# EasyEDA Pro project ProPrj_AD采集模组_2025-10-15.epro, schematic Schematic1
Board Name: AD采集; Create Date: 2025-08-20; Page Name: P1; Project Name: AD采集模组; Schematic Name: Schematic1; Update Date: 2025-09-16; Company: 嘉立创EDA; Page Size: A4; Version: V1.0
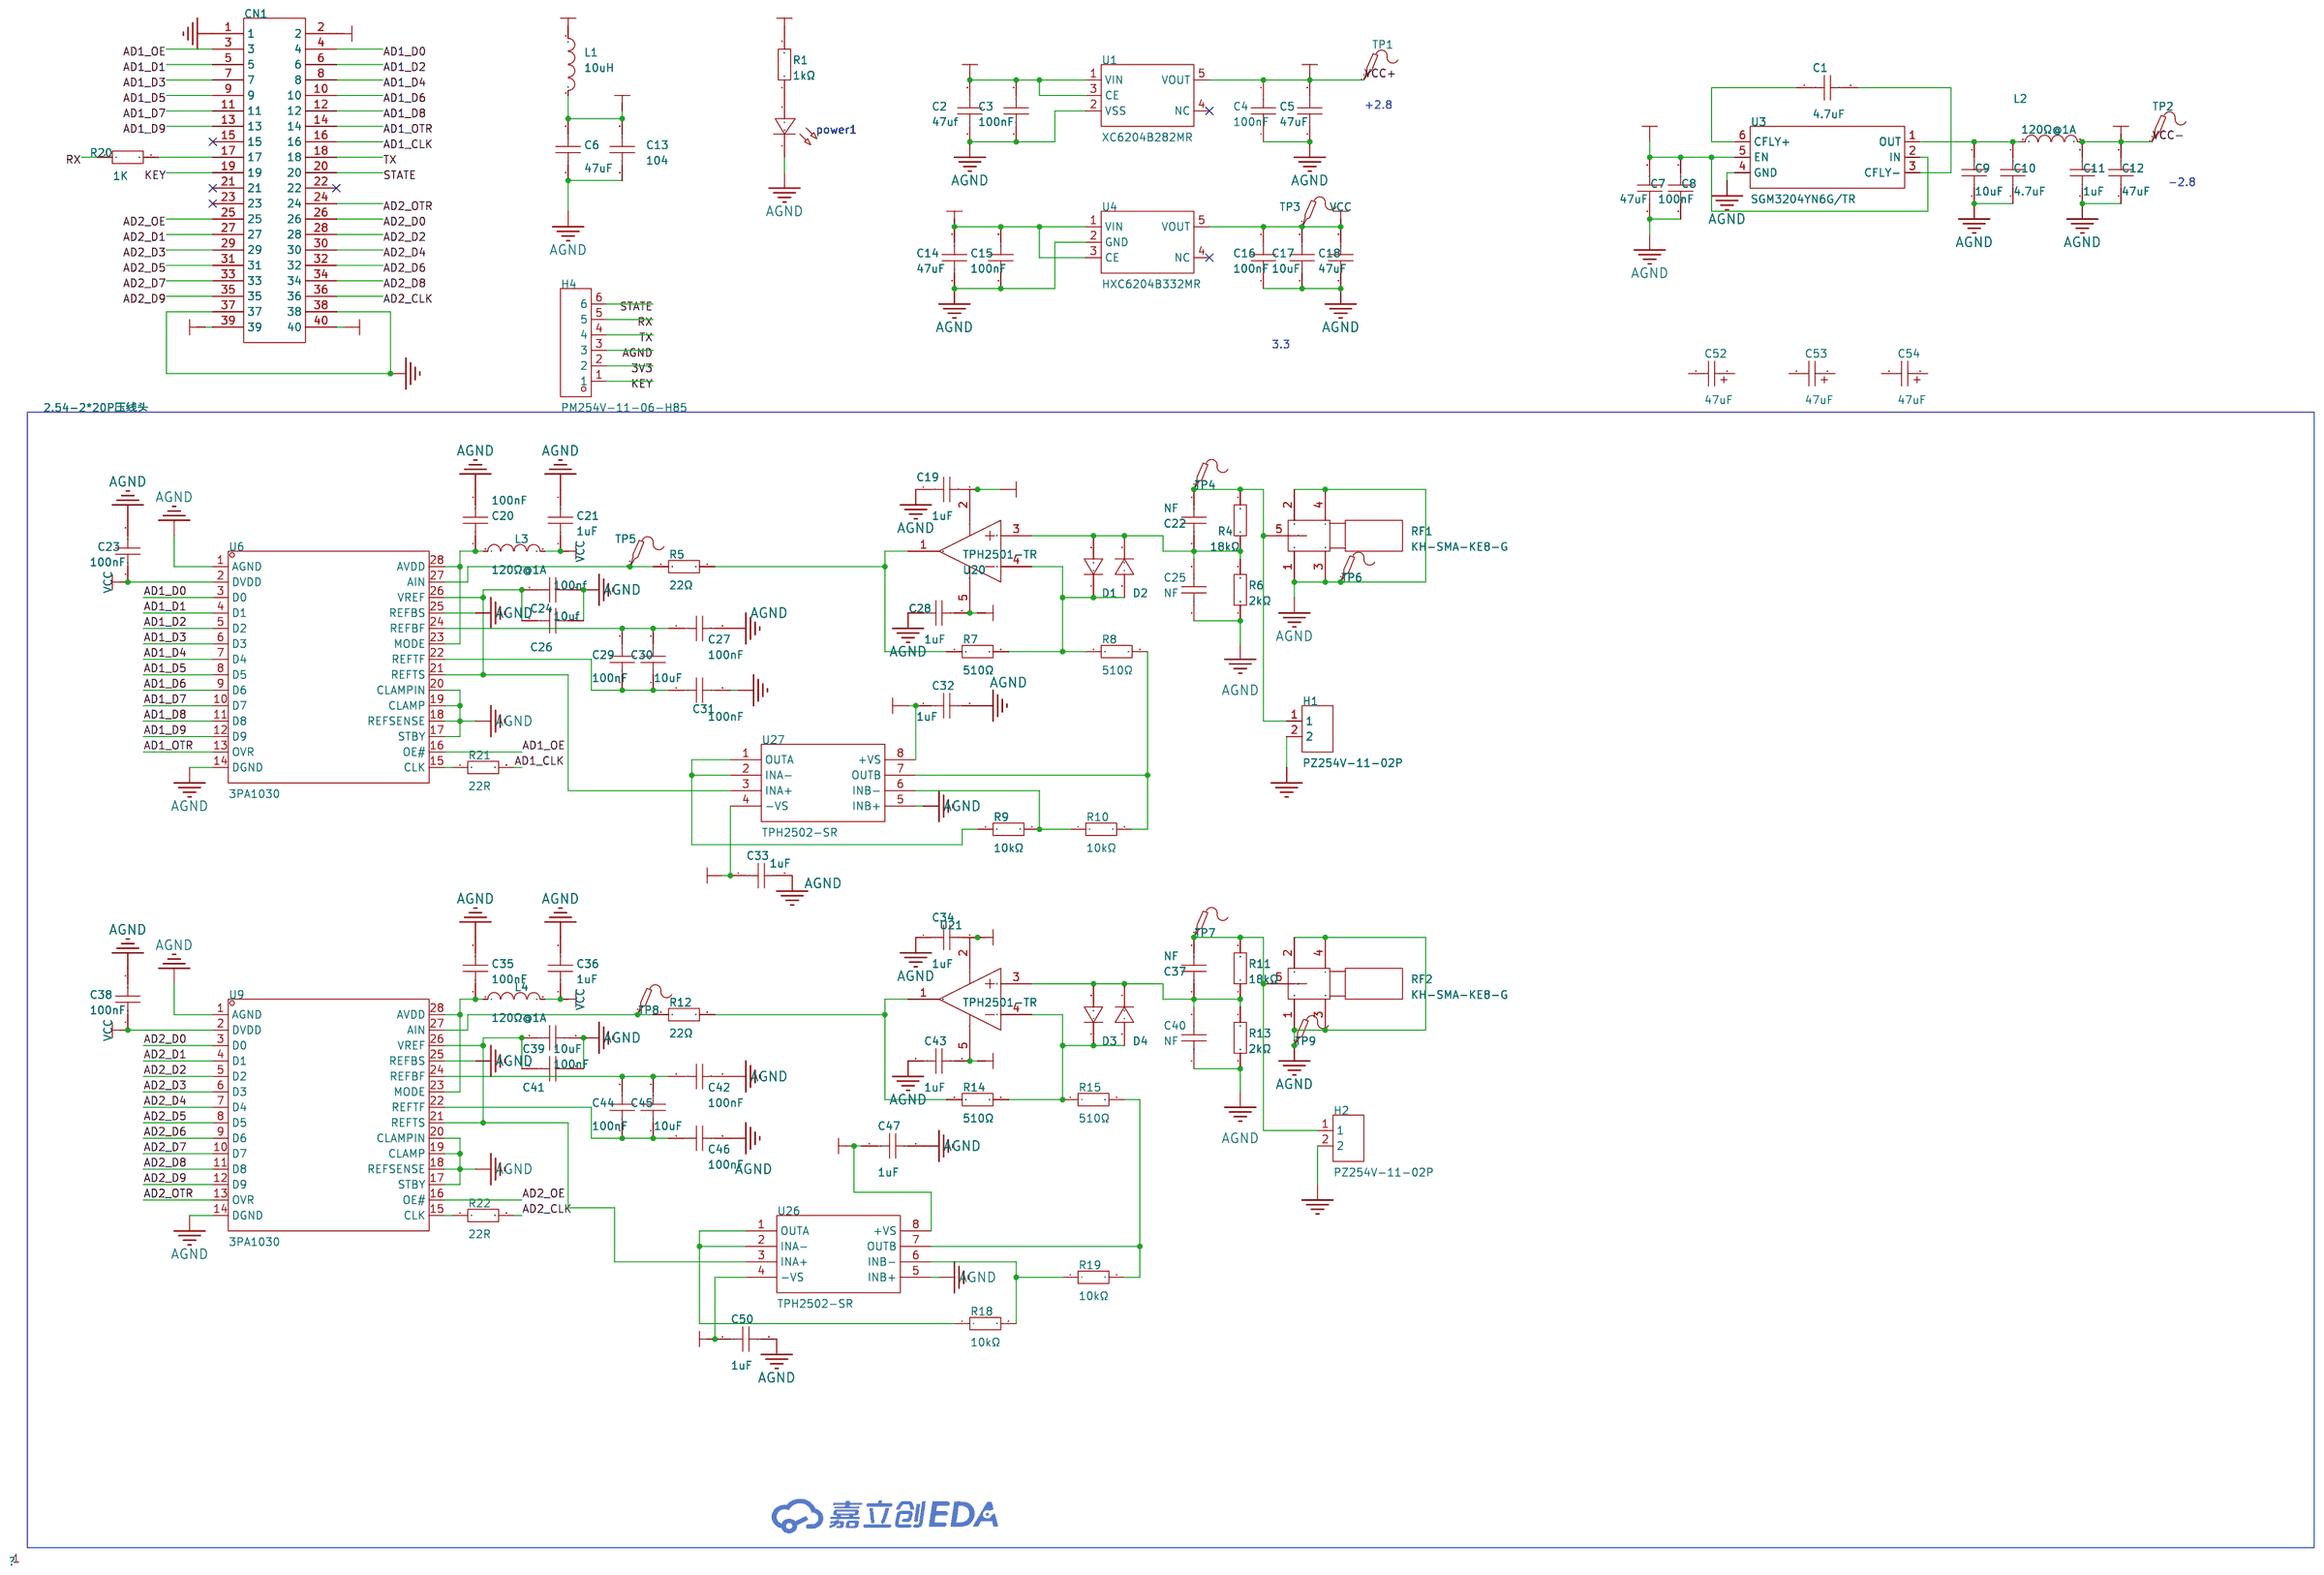
[diagram p0: schematic sheet]

## Parts
C1  4.7uF  [C0603]
C2  47uf  [C0603]
C3  100nF  [C0603]
C4  100nF  [C0603]
C5  47uF  [C0603]
C6  47uF  [C0603]
C7  47uF  [C0603]
C8  100nF  [C0603]
C9  10uF  [C0603]
C10  4.7uF  [C0603]
C11  1uF  [C0603]
C12  47uF  [C0603]
C13  100nF  [C0603]
C14  47uF  [C0603]
C15  100nF  [C0603]
C16  100nF  [C0603]
C17  10uF  [C0603]
C18  47uF  [C0603]
C19  1uF  [C0603]
C20  100nF  [C0603]
C21  1uF  [C0603]
C22  NF  [C0603]
C23  100nF  [C0603]
C24  100nf  [C0603]
C25  NF  [C0603]
C26  10uf  [C0603]
C27  100nF  [C0603]
C28  1uF  [C0603]
C29  100nF  [C0603]
C30  10uF  [C0603]
C31  100nF  [C0603]
C32  1uF  [C0603]
C33  1uF  [C0603]
C34  1uF  [C0603]
C35  100nF  [C0603]
C36  1uF  [C0603]
C37  NF  [C0603]
C38  100nF  [C0603]
C39  10uF  [C0603]
C40  NF  [C0603]
C41  100nF  [C0603]
C42  100nF  [C0603]
C43  1uF  [C0603]
C44  100nF  [C0603]
C45  10uF  [C0603]
C46  100nF  [C0603]
C47  1uF  [C0603]
C50  1uF  [C0603]
C52  47uF  [CASE-D_7343]
C53  47uF  [CASE-D_7343]
C54  47uF  [CASE-D_7343]
CN1  2.54-2*20P压线头  [HDR-TH_40P-V-H-R2-P2.54]
D1  1N4148W  [SOD-123F_L2.7-W1.6-LS3.8-RD]
D2  1N4148W  [SOD-123F_L2.7-W1.6-LS3.8-RD]
D3  1N4148W  [SOD-123F_L2.7-W1.6-LS3.8-RD]
D4  1N4148W  [SOD-123F_L2.7-W1.6-LS3.8-RD]
H1  PZ254V-11-02P  [HDR-TH_2P-P2.54-V-M]
H2  PZ254V-11-02P  [HDR-TH_2P-P2.54-V-M]
H4  PM254V-11-06-H85  [HDR-TH_6P-P2.54-V-F]
L1  10uH  [L0603]
L2  120Ω@1A  [L0603]
L3  120Ω@1A  [L0603]
L4  120Ω@1A  [L0603]
power1  LTST-C193TBKT-5A  [LED_0603]
R1  1kΩ  [R0603]
R4  18kΩ  [R0603]
R5  22Ω  [R0603]
R6  2kΩ  [R0603]
R7  510Ω  [R0603]
R8  510Ω  [R0603]
R9  10kΩ  [R0603]
R10  10kΩ  [R0603]
R11  18kΩ  [R0603]
R12  22Ω  [R0603]
R13  2kΩ  [R0603]
R14  510Ω  [R0603]
R15  510Ω  [R0603]
R18  10kΩ  [R0603]
R19  10kΩ  [R0603]
R20  1K  [R0603]
R21  22R  [R0603]
R22  22R  [R0603]
RF1  KH-SMA-KE8-G  [CONN-SMD_KH-SMA-KE8-G]
RF2  KH-SMA-KE8-G  [CONN-SMD_KH-SMA-KE8-G]
TP1  -  [Test-Point-0.5mm]
TP2  -  [Test-Point-0.5mm]
TP3  -  [Test-Point-0.5mm]
TP4  -  [Test-Point-0.5mm]
TP5  -  [Test-Point-0.5mm]
TP6  -  [Test-Point-0.5mm]
TP7  -  [Test-Point-0.5mm]
TP8  -  [Test-Point-0.5mm]
TP9  -  [Test-Point-0.5mm]
U1  XC6204B282MR  [SOT-23-5_L2.9-W1.6-P0.95-LS2.8-BR]
U3  SGM3204YN6G/TR  [SOT-23-6_L2.9-W1.6-P0.95-LS2.8-BR]
U4  HXC6204B332MR  [SOT-23-5_L3.0-W1.7-P0.95-LS2.8-BR]
U6  3PA1030  [TSSOP-28_L9.7-W4.4-P0.65-LS6.4-BL]
U9  3PA1030  [TSSOP-28_L9.7-W4.4-P0.65-LS6.4-BL]
U20  TPH2501-TR  [SOT-23-5_L3.0-W1.7-P0.95-LS2.8-BR]
U21  TPH2501-TR  [SOT-23-5_L3.0-W1.7-P0.95-LS2.8-BR]
U26  TPH2502-SR  [SOP-8_L4.9-W3.9-P1.27-LS6.0-BL]
U27  TPH2502-SR  [SOP-8_L4.9-W3.9-P1.27-LS6.0-BL]

## Library data of the parts
C1 C10 = CL10A475KA8NQNC: 容值:4.7uF;精度:±10%;额定电压:25V;温度系数:X5R;; LCSC Part Name: 4.7uF ±10% 25V; Supplier Part: C69335; Manufacturer: SAMSUNG(三星); Supplier Footprint: 0603; JLCPCB Part Class: Extended Part; Datasheet: https://item.szlcsc.com/datasheet/CL10A475KA8NQNC/70449.html; Supplier: LCSC; Tolerance: ±10%; Voltage Rating: 25V; Temperature Coefficient: X5R
C2-C5 C8 C13 C15 C16 C20 C23 C26 C27 C29 C31 C35 C38 C41 C42 C44 C46 = CC0603KRX7R9BB104: 容值:100nF;精度:±10%;额定电压:50V;温度系数:X7R;; LCSC Part Name: 100nF ±10% 50V; Supplier Part: C14663; Manufacturer: YAGEO(国巨); Supplier Footprint: 0603; JLCPCB Part Class: Basic Part; Datasheet: https://atta.szlcsc.com/upload/public/pdf/source/20250214/096C4C206003071F5D32E5F0D8E7F8DF.pdf; Supplier: LCSC; Tolerance: ±10%; Voltage Rating: 50V; Temperature Coefficient: X7R
C6 C7 C12 C14 C18 = GRM188R60J476ME15D: 容值:47uF;精度:±20%;额定电压:6.3V;温度系数:X5R;; LCSC Part Name: 47uF ±20% 6.3V; Supplier Part: C140782; Manufacturer: muRata(村田); Supplier Footprint: 0603; JLCPCB Part Class: Extended Part; Datasheet: https://item.szlcsc.com/datasheet/GRM188R60J476ME15D/152108.html; Supplier: LCSC; Tolerance: ±20%; Voltage Rating: 6.3V; Temperature Coefficient: X5R
C9 C17 C24 C30 C39 C45 = CL10A106KP8NNNC: 容值:10uF;精度:±10%;额定电压:10V;温度系数:X5R;; LCSC Part Name: 10uF ±10% 10V; Supplier Part: C19702; Manufacturer: SAMSUNG(三星); Supplier Footprint: 0603; JLCPCB Part Class: Basic Part; Datasheet: https://item.szlcsc.com/datasheet/CL10A106KP8NNNC/20411.html; Supplier: LCSC; Tolerance: ±10%; Voltage Rating: 10V; Temperature Coefficient: X5R
C11 C19 C21 C28 C32-C34 C36 C43 C47 C50 = CL10A105KB8NNNC: 容值:1uF;精度:±10%;额定电压:50V;温度系数:X5R;; LCSC Part Name: 1uF ±10% 50V; Supplier Part: C15849; Manufacturer: SAMSUNG(三星); Supplier Footprint: 0603; JLCPCB Part Class: Basic Part; Datasheet: https://item.szlcsc.com/datasheet/CL10A105KB8NNNC/16531.html; Supplier: LCSC; Tolerance: ±10%; Voltage Rating: 50V; Temperature Coefficient: X5R
C22 C25 C37 C40 = CAP_0603: Supplier Footprint: 0603
C52-C54 = TAJD476K016RNJ: 容值:47uF;精度:±10%;额定电压:16V;等效串联电阻:900mΩ@100kHz;; LCSC Part Name: 47uF ±10% 16V; Supplier Part: C7227; Manufacturer: Kyocera AVX; Supplier Footprint: CASE-D-7343; JLCPCB Part Class: 扩展库; Datasheet: https://atta.szlcsc.com/upload/public/pdf/source/20160107/1457707750344.pdf; Supplier: LCSC; Tolerance: ±10%; Rated Voltage: 16V; Equivalent Series Resistance(ESR): 900mΩ@100kHz; Operating Temperature: -55℃~+125℃
CN1 = 2.54-2*20P压线头: 连接器类型:IDC连接器;间距:2.54mm;安装方式:三件式(连接器+压排+反折盖);行距:2.54mm;排数:2;触头材质:黄铜;触头镀层:金;; LCSC Part Name: 三件套 2.54mm 排数:2; Supplier Part: C21856; Manufacturer: BOOMELE(博穆精密); Supplier Footprint: P=2.54mm; JLCPCB Part Class: 扩展库; Datasheet: https://item.szlcsc.com/datasheet/2.54-2*20P%25E5%258E%258B%25E7%25BA%25BF%25E5%25A4%25B4/22578.html; Supplier: LCSC; Connector Type: IDC连接器; Pitch: 2.54mm; Holder Type: 三件式(连接器+压排+反折盖); Row Spacing: 2.54mm; Number of Rows: 2; Contact Material: 黄铜; Contact Plating: 金
D1-D4 = 1N4148W_C81598: 二极管配置:独立式;正向压降(Vf):1V@50mA;直流反向耐压(Vr):75V;整流电流:150mA;反向恢复时间(Trr):4ns;; Supplier Part: C81598; Manufacturer: ST(先科); Supplier Footprint: SOD-123; JLCPCB Part Class: 基础库; Datasheet: https://item.szlcsc.com/datasheet/1N4148W/82750.html; Supplier: LCSC; Diode Configuration: 独立式; Voltage - Forward(Vf@If): 1V@50mA; Voltage - DC Reverse(Vr): 75V; Current - Rectified: 150mA; Pd - Power Dissipation: 400mW; Reverse Leakage Current (Ir): 1uA@75V; Reverse Recovery Time (trr): 4ns; Non-Repetitive Peak Forward Surge Current: 1A
H1 H2 = PZ254V-11-02P: 插针结构:1x2P;间距:2.54mm;行距:-;圆针/方针:方针;安装方式:直插;排数:单排;总PIN位数:2P;额定电流:-;额定电压:-;配合针长度:6mm;塑高:2.5mm;端接针长度:3mm;触头材质:黄铜;触头镀层:-;工作温度:-40℃~+105℃;颜色:黑色;; LCSC Part Name: 1x2P 间距:2.54mm 方针 直插; Supplier Part: C492401; Manufacturer: XFCN(兴飞); Supplier Footprint: 插件,P=2.54mm; JLCPCB Part Class: 扩展库; Datasheet: https://item.szlcsc.com/datasheet/PZ254V-11-02P/502957.html; Supplier: LCSC; Pin Structure: 1x2P; Pitch: 2.54mm; Circluar Pins/Square Pins: 方针; Mounting Type: 直插; Number of Rows: 单排; Number of Pins: 2P; Length of Mating Pin: 6mm; Insulation Height: 2.5mm; Length of End Connection Pin: 3mm; Contact Material: 黄铜; Operating Temperature: -40℃~+105℃; Color: 黑色
H4 = PM254V-11-06-H85: 插孔结构:1x6P;间距:2.54mm;行距:-;圆孔/方孔:方孔;安装方式:直插;排数:单排;总孔位数:6P;额定电流:3A;额定电压:250V;插孔方向:顶部;塑高:-;工作温度:-40℃~+105℃;; LCSC Part Name: 间距:2.54mm 1x6P 直插; Supplier Part: C2832269; Manufacturer: XFCN(兴飞); Supplier Footprint: 插件,P=2.54mm; JLCPCB Part Class: 扩展库; Datasheet: https://item.szlcsc.com/datasheet/PM254V-11-06-H85/2989787.html; Supplier: LCSC; Holes Structure: 1x6P; Pitch: 2.54mm; Circular Hole / Square Hole: 方孔; Mounting Type: 直插; Number of Rows: 单排; Number of Positions: 6P; Current Rating: 3A; Voltage Rating (Max): 250V; Holes Direction: 顶部; Operating Temperature: -40℃~+105℃
L1 = SDFL1608S100KTF: 电感值:10uH;精度:±10%;额定电流:3mA;饱和电流(Isat):-;直流电阻(DCR):1.85Ω;; LCSC Part Name: 10uH ±10%; Supplier Part: C1035; Manufacturer: Sunlord(顺络); Supplier Footprint: 0603; JLCPCB Part Class: Basic Part; Datasheet: https://item.szlcsc.com/datasheet/SDFL1608S100KTF/1387.html; Supplier: LCSC; Tolerance: ±10%; Current Rating: 3mA; DC Resistance(DCR): 1.85Ω; Q @ Frequency: 30@2MHz; Frequency - Self Resonant: 17MHz
L2-L4 = 0603WAF1200T5E: 电阻类型:厚膜电阻;阻值:120Ω;精度:±1%;功率:100mW;最大工作电压:75V;温度系数:±100ppm/℃;; LCSC Part Name: 120Ω ±1% 100mW 厚膜电阻; Supplier Part: C22787; Manufacturer: UNI-ROYAL(厚声); Supplier Footprint: 0603; JLCPCB Part Class: Basic Part; Datasheet: https://atta.szlcsc.com/upload/public/pdf/source/20200306/C422600_1E6D84923E4A46A82E41ADD87F860B5C.pdf; Supplier: LCSC; Type: 厚膜电阻; Tolerance: ±1%; Power(Watts): 100mW; Overload Voltage (Max): 75V; Temperature Coefficient: ±100ppm/℃; Operating Temperature Range: -55℃~+155℃
power1 = LTST-C193TBKT-5A: 发光颜色:蓝色;正向压降(Vf):2.8V;功率:76mW;正向电流:5mA;波长:465nm~475nm;二极管配置:-;透镜颜色:无色透明透镜;色温:-;发光强度:15mcd;发光角度:130°;载带方式:-;工作温度:-20℃~+80℃;; LCSC Part Name: 蓝灯; Supplier Part: C125103; Manufacturer: LITEON(光宝); Supplier Footprint: 0603; JLCPCB Part Class: Extended Part; Datasheet: https://atta.szlcsc.com/upload/public/pdf/source/20171230/C125103_15146280496221222053.pdf; Supplier: LCSC; Illumination Color: 蓝色; Voltage - Forward(Vf): 2.8V; Power(Watts): 76mW; Forward Current: 5mA; Wavelength - Dominant: 465nm~475nm; Peak Wavelength: 468nm; Lens Color: 无色透明透镜; Luminous Intensity: 15mcd; Viewing Angle: 130°; Operating Temperature: -20℃~+80℃
R1 = 0603WAF1001T5E: 电阻类型:厚膜电阻;阻值:1kΩ;精度:±1%;功率:100mW;最大工作电压:75V;温度系数:±100ppm/℃;; LCSC Part Name: 1kΩ ±1% 100mW 厚膜电阻; Supplier Part: C21190; Manufacturer: UNI-ROYAL(厚声); Supplier Footprint: 0603; JLCPCB Part Class: Basic Part; Datasheet: https://atta.szlcsc.com/upload/public/pdf/source/20200306/C422600_1E6D84923E4A46A82E41ADD87F860B5C.pdf; Supplier: LCSC; Type: 厚膜电阻; Tolerance: ±1%; Power(Watts): 100mW; Overload Voltage (Max): 75V; Temperature Coefficient: ±100ppm/℃; Operating Temperature Range: -55℃~+155℃
R4 R11 = 0603WAF1802T5E: 电阻类型:厚膜电阻;阻值:18kΩ;精度:±1%;功率:100mW;工作电压:75V;温度系数:±100ppm/℃;; LCSC Part Name: 18kΩ ±1% 100mW 厚膜电阻; Supplier Part: C25810; Manufacturer: UNI-ROYAL(厚声); Supplier Footprint: 0603; JLCPCB Part Class: Basic Part; Datasheet: https://item.szlcsc.com/datasheet/0603WAF1802T5E/26553.html; Supplier: LCSC; Type: 厚膜电阻; Tolerance: ±1%; Power(Watts): 100mW; Voltage-Supply(Max): 75V; Temperature Coefficient: ±100ppm/℃; Operating Temperature: -55℃~+155℃
R5 R12 = 0603WAF220JT5E: 电阻类型:厚膜电阻;阻值:22Ω;精度:±1%;功率:100mW;最大工作电压:75V;温度系数:±100ppm/℃;; LCSC Part Name: 22Ω ±1% 100mW 厚膜电阻; Supplier Part: C23345; Manufacturer: UNI-ROYAL(厚声); Supplier Footprint: 0603; JLCPCB Part Class: Basic Part; Datasheet: https://atta.szlcsc.com/upload/public/pdf/source/20200306/C422600_1E6D84923E4A46A82E41ADD87F860B5C.pdf; Supplier: LCSC; Type: 厚膜电阻; Tolerance: ±1%; Power(Watts): 100mW; Overload Voltage (Max): 75V; Temperature Coefficient: ±100ppm/℃; Operating Temperature Range: -55℃~+155℃
R6 R13 = 0603WAF2001T5E: 电阻类型:厚膜电阻;阻值:2kΩ;精度:±1%;功率:100mW;工作电压:75V;温度系数:±100ppm/℃;; LCSC Part Name: 2kΩ ±1% 100mW 厚膜电阻; Supplier Part: C22975; Manufacturer: UNI-ROYAL(厚声); Supplier Footprint: 0603; JLCPCB Part Class: Basic Part; Datasheet: https://item.szlcsc.com/datasheet/0603WAF2001T5E/23702.html; Supplier: LCSC; Type: 厚膜电阻; Tolerance: ±1%; Power(Watts): 100mW; Voltage-Supply(Max): 75V; Temperature Coefficient: ±100ppm/℃; Operating Temperature: -55℃~+155℃
R7 R8 R14 R15 = 0603WAF5100T5E: 电阻类型:厚膜电阻;阻值:510Ω;精度:±1%;功率:100mW;工作电压:75V;温度系数:±100ppm/℃;; LCSC Part Name: 510Ω ±1% 100mW 厚膜电阻; Supplier Part: C23193; Manufacturer: UNI-ROYAL(厚声); Supplier Footprint: 0603; JLCPCB Part Class: Basic Part; Datasheet: https://item.szlcsc.com/datasheet/0603WAF5100T5E/23920.html; Supplier: LCSC; Type: 厚膜电阻; Tolerance: ±1%; Power(Watts): 100mW; Voltage-Supply(Max): 75V; Temperature Coefficient: ±100ppm/℃; Operating Temperature: -55℃~+155℃
R9 R10 R18 R19 = 0603WAF1002T5E: 电阻类型:厚膜电阻;阻值:10kΩ;精度:±1%;功率:100mW;工作电压:75V;温度系数:±100ppm/℃;; LCSC Part Name: 厚膜电阻 10kΩ ±1% 100mW; Supplier Part: C25804; Manufacturer: UNI-ROYAL(厚声); Supplier Footprint: 0603; JLCPCB Part Class: Basic Part; Datasheet: https://item.szlcsc.com/datasheet/0603WAF1002T5E/26547.html; Supplier: LCSC; Type: 厚膜电阻; Tolerance: ±1%; Power(Watts): 100mW; Voltage-Supply(Max): 75V; Temperature Coefficient: ±100ppm/℃; Operating Temperature: -55℃~+155℃
R20-R22 = Res_0603: Supplier Footprint: 0603
RF1 RF2 = KH-SMA-KE8-G: 连接器类型:板端;接口类型:内孔;端口数量:1;接口直径:-;接口长度/高度:8mm;频率-最大值:-;射频系列:SMA;阻抗:-;样式:偏脚;工作温度范围:-;; LCSC Part Name: SMA 内孔 偏脚; Supplier Part: C530661; Manufacturer: kinghelm(金航标); Supplier Footprint: 插件; JLCPCB Part Class: 扩展库; Datasheet: https://atta.szlcsc.com/upload/public/pdf/source/20200512/C530661_F969D51668E6BC228544FB5FCDBC3D39.pdf; Supplier: LCSC; Connector Type: 板端; Interface Type: 内孔; Number of Ports: 1; Interface Length/Height: 8mm; RF Series: SMA; Style: 偏脚
TP1-TP9 = Test-Point: Test Point 测试点
U1 = XC6204B282MR_C18212677: 输出类型:固定;工作电压:24V;输出电压:2.8V;输出电流:300mA;电源纹波抑制比(PSRR):-;输出极性:正极;; Supplier Part: C18212677; Manufacturer: TECH PUBLIC(台舟); Supplier Footprint: SOT-23-5; JLCPCB Part Class: 扩展库; Datasheet: https://atta.szlcsc.com/upload/public/pdf/source/20231024/BB7AFA2097FD6BAC04A00C1B2E1A616C.pdf; Supplier: LCSC; Output Type: 固定; Voltage - Supply: 24V; Output Voltage: 2.8V; Output Current: 300mA; Operating Temperature: -40℃~+125℃@(Tj); Output Configuration: 正极; Number of Outputs: 1
U3 = SGM3204YN6G/TR: 电荷泵芯片，开关电容式电压变换器，最大输出200mA,可用于运放放大、滤波等电路; Supplier Part: C194031; Manufacturer: SGMICRO(圣邦微); Supplier Footprint: SOT-23-6; JLCPCB Part Class: 扩展库; Datasheet: https://item.szlcsc.com/datasheet/SGM3204YN6G%252FTR/234001.html; Supplier: LCSC
U4 = HXC6204B332MR: 输出类型:固定;工作电压:6V;输出电压:3.3V;输出电流:300mA;电源纹波抑制比(PSRR):75dB@(1kHz);输出极性:正极;; LCSC Part Name: IO:0.3A VO:3.3V VI:6V; Supplier Part: C41381691; Manufacturer: HXY MOSFET(华轩阳电子); Supplier Footprint: SOT-23-5L; JLCPCB Part Class: 扩展库; Datasheet: https://atta.szlcsc.com/upload/public/pdf/source/20240906/25A9FBEB6AED510B5D7C53CC517AC27A.pdf; Supplier: LCSC; Output Type: 固定; Voltage - Supply: 6V; Output Voltage: 3.3V; Output Current: 300mA; Power Supply Rejection Ratio (PSRR): 75dB@(1kHz); Voltage Dropout: 35mV@(100mA)；280mV@(200mA); standby current: 25uA; Noise: 50uVrms; Features: 带使能; Operating Temperature: -20℃~+60℃; Output Configuration: 正极; Number of Outputs: 1
U6 U9 = 3PA1030: 分辨率:10位;采样率:50MHz;工作电压:2.7V~5.5V;接口类型:-;; LCSC Part Name: 50MHz 10位ADC; Supplier Part: C248725; Manufacturer: 3PEAK(思瑞浦); Supplier Footprint: TSSOP-28; JLCPCB Part Class: 扩展库; Datasheet: https://atta.szlcsc.com/upload/public/pdf/source/20180820/C248725_75EFE3116FC07E3793E168E287E3107F.pdf; Supplier: LCSC; Resolution(Bits): 10位; Sampling Rate: 50MHz; Voltage - Supply: 2.7V~5.5V; Integral non - linearity: 0.9LSB; Operating Temperature: -40℃~+85℃
U20 U21 = OPA365AIDBVR: 放大器数:单路;轨到轨:-;增益带宽积(GBP):50MHz;压摆率(SR):25V/us;输入偏置电流(Ib):0.2pA;; Supplier Part: C96626; Manufacturer: TI(德州仪器); Supplier Footprint: SOT-23-5; JLCPCB Part Class: 扩展库; Datasheet: https://www.ti.com/cn/lit/gpn/opa365; Supplier: LCSC; Number of Channels: 单路; Gain Bandwidth Product: 50MHz; Slew Rate: 25V/us; Ib - Input Bias Current: 0.2pA; Output Current: 65mA; Operating Temperature: -40℃~+125℃
U26 U27 = TPH2502-SR: 放大器数:双路;轨到轨:轨到轨输入,轨到轨输出;增益带宽积(GBP):120MHz;输入失调电压(Vos):50uV;压摆率(SR):180V/us;输入偏置电流(Ib):0.3pA;; Supplier Part: C118223; Manufacturer: 3PEAK(思瑞浦); Supplier Footprint: SOP-8; JLCPCB Part Class: 扩展库; Datasheet: https://atta.szlcsc.com/upload/public/pdf/source/20180820/C248592_EC92046997BE718B1CFA256C8CC8079C.pdf; Supplier: LCSC; Number of Circuits: 双路; Maximum Power Supply Range (Vdd-Vss): 5.5V; Rail to Rail: 轨到轨输入,轨到轨输出; Gain Bandwidth Product(GBP): 120MHz; Voltage - Input Offset(Vos): 50uV; Input Offset Voltage Drift (Vos TC): 2uV/℃; Slew Rate(SR): 180V/us; Current - Input Bias(Ib): 0.3pA; Noise density(eN): 6.5nV/√Hz@1MHz; Common Mode Rejection Ratio (CMRR): 85dB; Quiescent Current: 6.5mA; Operating Temperature: -40℃~+125℃

## Nets
3V3: CN1.39 CN1.40 H4.2
AGND: C2.1 C3.1 C4.1 C5.1 C6.1 C7.1 C8.1 C9.1 C10.1 C11.1 C12.1 C13.1 C14.1 C15.1 C16.1 C17.1 C18.1 C19.1 C20.2 C21.2 C23.2 C24.2 C25.1 C26.2 C27.2 C28.1 C31.2 C32.2 C33.2 C34.1 C35.2 C36.2 C38.2 C39.2 C40.1 C41.2 C42.2 C43.1 C46.2 C47.2 C50.2 CN1.1 CN1.37 CN1.38 H1.2 H2.2 H4.3 power1.1(C) R6.2 R13.2 RF1.1 RF1.2 RF1.3 RF1.4 RF2.1 RF2.2 RF2.3 RF2.4 TP6.1 TP9.1 U1.2(VSS) U3.4(GND) U4.2(GND) U6.1(AGND) U6.14(DGND) U6.17(STBY) U6.18(REFSENSE) U6.19(CLAMP) U6.20(CLAMPIN) U6.25(REFBS) U9.1(AGND) U9.14(DGND) U9.17(STBY) U9.18(REFSENSE) U9.19(CLAMP) U9.20(CLAMPIN) U9.25(REFBS) U26.5(INB+) U27.5(INB+)
VCC: C16.2 C17.2 C18.2 C21.1 C23.1 C36.1 C38.1 L3.2 L4.2 TP3.1 U4.5(VOUT) U6.2(DVDD) U9.2(DVDD)
VCC+: C4.2 C5.2 C7.2 C8.2 C28.2 C32.1 C43.2 C47.1 TP1.1 U1.5(VOUT) U3.2(IN) U3.5(EN) U20.5(VS+) U21.5(VS+) U26.8(+VS) U27.8(+VS)
VCC-: C11.2 C12.2 C19.2 C33.1 C34.2 C50.1 L2.2 TP2.1 U20.2(VS-) U21.2(VS-) U26.4(-VS) U27.4(-VS)
VCC_5V: C2.2 C3.2 C6.2 C13.2 C14.2 C15.2 L1.2 R1.2 U1.1(VIN) U1.3(CE) U4.1(VIN) U4.3(CE)
VCC_IN: CN1.2 L1.1
AD1_CLK: CN1.16 R21.2
AD1_D0: CN1.4 U6.3(D0)
AD1_D1: CN1.5 U6.4(D1)
AD1_D2: CN1.6 U6.5(D2)
AD1_D3: CN1.7 U6.6(D3)
AD1_D4: CN1.8 U6.7(D4)
AD1_D5: CN1.9 U6.8(D5)
AD1_D6: CN1.10 U6.9(D6)
AD1_D7: CN1.11 U6.10(D7)
AD1_D8: CN1.12 U6.11(D8)
AD1_D9: CN1.13 U6.12(D9)
AD1_OE: CN1.3 U6.16(OE#)
AD1_OTR: CN1.14 U6.13(OVR)
AD2_CLK: CN1.36 R22.2
AD2_D0: CN1.26 U9.3(D0)
AD2_D1: CN1.27 U9.4(D1)
AD2_D2: CN1.28 U9.5(D2)
AD2_D3: CN1.29 U9.6(D3)
AD2_D4: CN1.30 U9.7(D4)
AD2_D5: CN1.31 U9.8(D5)
AD2_D6: CN1.32 U9.9(D6)
AD2_D7: CN1.33 U9.10(D7)
AD2_D8: CN1.34 U9.11(D8)
AD2_D9: CN1.35 U9.12(D9)
AD2_OE: CN1.25 U9.16(OE#)
AD2_OTR: CN1.24 U9.13(OVR)
KEY: CN1.19 H4.1
RX: H4.5 R20.1
STATE: CN1.20 H4.6
TX: CN1.18 H4.4
$1N1392: C22.2 H1.1 R4.2 RF1.5 TP4.1
$1N2309: D1.1(K) D2.2(A) R7.2 R8.1 U20.4(IN-)
$1N2656: R8.2 R10.2 U27.7(OUTB)
$1N3284: R5.1 TP5.1 U6.27(AIN)
$1N3290: R5.2 R7.1 U20.1(OUT)
$1N3540: C20.1 L3.1 U6.23(MODE) U6.28(AVDD)
$1N3734: C29.1 C30.1 C31.1 U6.22(REFTF)
$1N3888: C27.1 C29.2 C30.2 U6.24(REFBF)
$1N4080: R21.1 U6.15(CLK)
$1N10331: C1.1 U3.6(CFLY+)
$1N10336: C1.2 U3.3(CFLY-)
$1N10485: C9.2 C10.2 L2.1 U3.1(OUT)
$1N11129: power1.2(A) R1.1
$1N12612: C37.2 H2.1 R11.2 RF2.5 TP7.1
$1N12618: D3.1(K) D4.2(A) R14.2 R15.1 U21.4(IN-)
$1N12621: R15.2 R19.2 U26.7(OUTB)
$1N12626: R12.1 TP8.1 U9.27(AIN)
$1N12627: R12.2 R14.1 U21.1(OUT)
$1N12628: C39.1 C41.1 U9.21(REFTS) U9.26(VREF) U26.3(INA+)
$1N12630: C35.1 L4.1 U9.23(MODE) U9.28(AVDD)
$1N12634: C44.1 C45.1 C46.1 U9.22(REFTF)
$1N12635: C42.1 C44.2 C45.2 U9.24(REFBF)
$1N17421: C22.1 C25.2 D1.2(A) D2.1(K) R4.1 R6.1 U20.3(IN+)
$1N17460: C37.1 C40.2 D3.2(A) D4.1(K) R11.1 R13.1 U21.3(IN+)
$1N58701: CN1.17 R20.2
$1N80519: R18.1 U26.1(OUTA) U26.2(INA-)
$1N80652: R18.2 R19.1 U26.6(INB-)
$1N81228: C24.1 C26.1 U6.21(REFTS) U6.26(VREF) U27.3(INA+)
$1N81237: R9.1 U27.1(OUTA) U27.2(INA-)
$1N81279: R9.2 R10.1 U27.6(INB-)
$1N84264: R22.1 U9.15(CLK)

Not connected (* = marked no-connect by the designer): C52 1 2; C53 1 2; C54 1 2; CN1 15* 21* 22* 23*; U1 4(NC)*; U4 4(NC)*

## Notes on the sheet
- +2.8
- -2.8
- 3.3
